# EAGLE design transmitter (EAGLE 9.6.2)
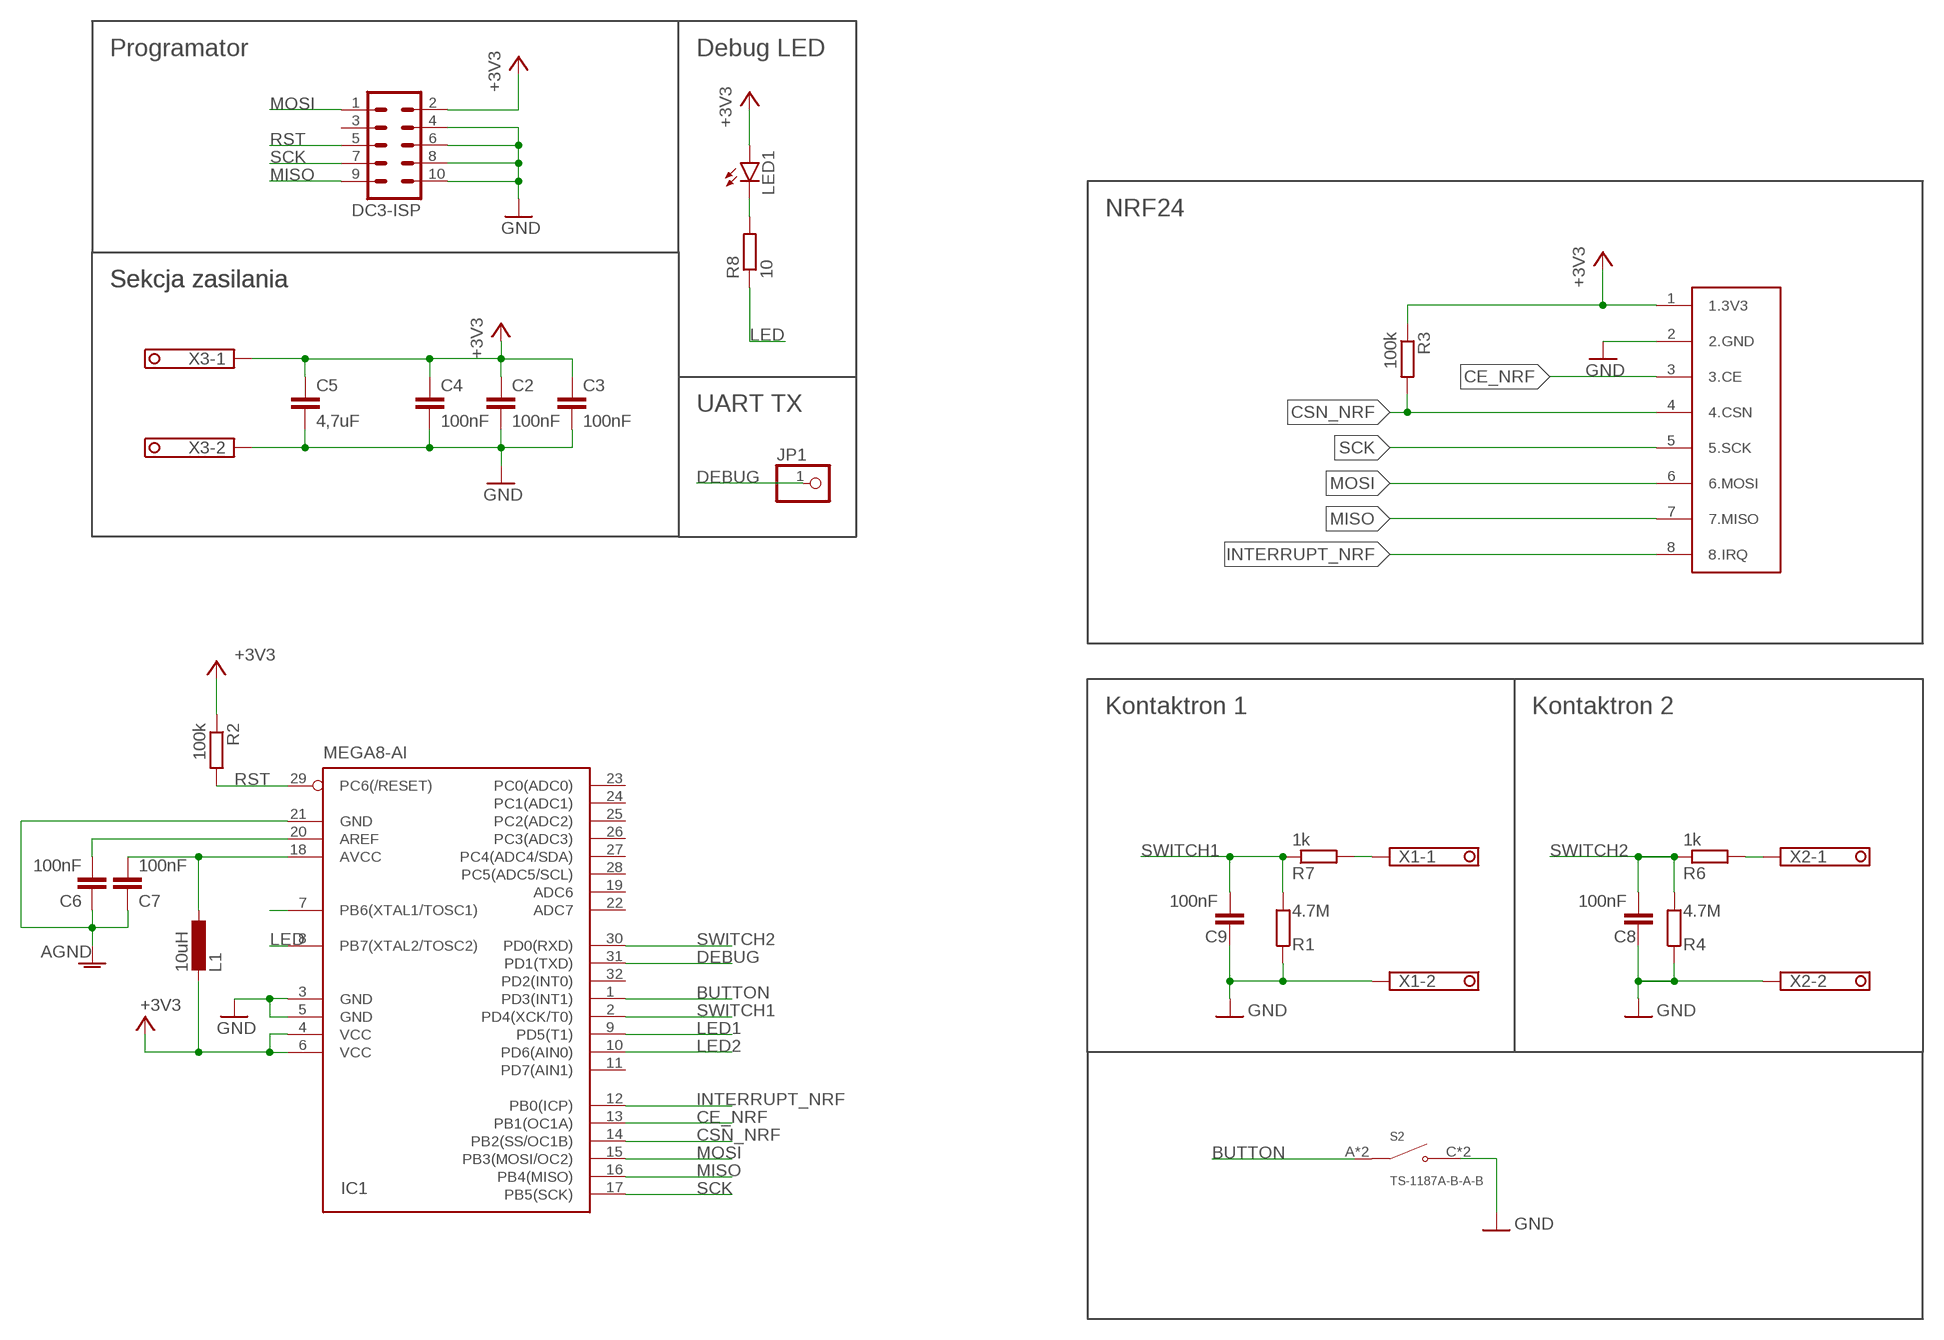
[diagram p0: schematic, sheet 1]

## Parts
C2  100nF  C-EUC0805  [C0805]
C3  100nF  C-EUC0805  [C0805]
C4  100nF  C-EUC0805  [C0805]
C5  4,7uF  C-EU025-050X050  [C025-050X050]
C6  100nF  C-EUC0805  [C0805]
C7  100nF  C-EUC0805  [C0805]
C8  100nF  C-EUC0805  [C0805]
C9  100nF  C-EUC0805  [C0805]
DC3-ISP  ML10  [ML10]
IC1  MEGA8-AI  [TQFP32-08]
JP1  PINHD-1X1  [1X01]
L1  10uH  L-EUL2012C  [L2012C]
LED1  LEDCHIP-LED0805  [CHIP-LED0805]
R1  4.7M  R-EU_M0805  [M0805]
R2  100k  R-EU_M0805  [M0805]
R3  100k  R-EU_M0805  [M0805]
R4  4.7M  R-EU_M0805  [M0805]
R6  1k  R-EU_M0805  [M0805]
R7  1k  R-EU_M0805  [M0805]
R8  10  R-EU_M0805  [M0805]
S2  TS-1187A-B-A-B  [SW_TS-1187A-B-A-B]
U$1  NRF24L01+  [NRF24L01+]
X1  ARK-3.5MMAPC2  [1751248]
X2  ARK-3.5MMAPC2  [1751248]
X3  ARK-3.5MMAPC2  [1751248]

## Nets
+3V3 [vcc]: C2.1 C3.1 C4.1 C5.1 DC3-ISP.2 IC1.4(VCC) IC1.6(VCC) L1.2 LED1.A R2.1 R3.1 U$1.1(1.3V3) X3.1
AGND: C6.1 C7.1 IC1.21(GND)
AREF: C6.2 IC1.20(AREF)
AVCC: C7.2 IC1.18(AVCC) L1.1
BUTTON: IC1.1(PD3(INT1)) S2.A(COM) S2.B(COM)
CE_NRF: IC1.13(PB1(OC1A)) U$1.3(3.CE)
CSN_NRF: IC1.14(PB2(SS/OC1B)) R3.2 U$1.4(4.CSN)
DEBUG: IC1.31(PD1(TXD)) JP1.1
GND [vcc]: C2.2 C3.2 C4.2 C5.2 C8.1 C9.1 DC3-ISP.4 DC3-ISP.6 DC3-ISP.8 DC3-ISP.10 IC1.3(GND) IC1.5(GND) R1.1 R4.1 S2.C(NO) S2.D(NO) U$1.2(2.GND) X1.2 X2.2 X3.2
INTERRUPT_NRF: IC1.12(PB0(ICP)) U$1.8(8.IRQ)
LED: IC1.8(PB7(XTAL2/TOSC2)) R8.1
LED1: IC1.9(PD5(T1))
LED2: IC1.10(PD6(AIN0))
MISO: DC3-ISP.9 IC1.16(PB4(MISO)) U$1.7(7.MISO)
MOSI: DC3-ISP.1 IC1.15(PB3(MOSI/OC2)) U$1.6(6.MOSI)
N$1: IC1.7(PB6(XTAL1/TOSC1))
N$2: LED1.C R8.2
RST: DC3-ISP.5 IC1.29(PC6(/RESET)) R2.2
SCK: DC3-ISP.7 IC1.17(PB5(SCK)) U$1.5(5.SCK)
SWITCH1: C9.2 IC1.2(PD4(XCK/T0)) R1.2 R7.1
SWITCH1_WIRE: R7.2 X1.1
SWITCH2: C8.2 IC1.30(PD0(RXD)) R4.2 R6.1
SWITCH2_WIRE: R6.2 X2.1
Unconnected: DC3-ISP.3 IC1.11(PD7(AIN1)) IC1.19(ADC6) IC1.22(ADC7) IC1.23(PC0(ADC0)) IC1.24(PC1(ADC1)) IC1.25(PC2(ADC2)) IC1.26(PC3(ADC3)) IC1.27(PC4(ADC4/SDA)) IC1.28(PC5(ADC5/SCL)) IC1.32(PD2(INT0))

## Notes on the sheet
- Programator | Debug LED
- NRF24
- Sekcja zasilania | Sekcja zasilania
- UART TX
- Kontaktron 1 | Kontaktron 2

## Library data of the parts
C2-C9 = rcl:C-EU: CAPACITOR, European symbol; SPICEPREFIX: C
DC3-ISP = Connectors:ML10: HARTING; OC_FARNELL: unknown; OC_NEWARK: unknown
IC1 = atmel:MEGA8: MICROCONTROLLER 8 Kbytes FLASH, 1 kbytes SRAM, 512 bytes EEPROM, USART, 6-channel 10 bit ADC, 2-channel 8 bit ADC Pin compatible with Atmega48, ATMega88, ATMega168 Source: avr.lbr; MPN: ATMEGA8-16AU; OC_FARNELL: 9171371; OC_NEWARK: 73M8863
JP1 = Connectors:PINHD-1X1: PIN HEADER
L1 = rcl:L-EU: INDUCTOR, European symbol; SPICEPREFIX: L
LED1 = led:LED: LED OSRAM: - CHIPLED LG R971, LG N971, LY N971, LG Q971, LY Q971, LO R971, LY R971 LH N974, LH R974 LS Q976, LO Q976, LY Q976 LO Q996 - Hyper CHIPLED LW Q18S LB Q993, LB Q99A, LB R99A - SideLED LS A670, LO A670, LY A670, LG A670, LP A670 LB A673, LV A673, LT A673, LW A673 LH A674 LY A675 LS A676, LA A676, LO A676, LY A676, LW A676 LS A679, LY A679, LG A679 - Hyper Micro SIDELED® LS Y876, LA Y876, LO Y876, LY Y876 LT Y87S - SmartLED LW L88C, LW L88S LB L89C, LB L89S, LG L890 LS L89K, LO L89K, LY L89K LS L896, LA L896, LO L896, LY L896 - TOPLED LS T670, LO T670, LY T670, LG T670, LP T670 LSG T670, LSP T670, LSY T670, LOP T670, LYG T670 LG T671, LOG T671, LSG T671 LB T673, LV T673, LT T673, LW T673 LH T674 LS T676, LA T676, LO T676, LY T676, LB T676, LH T676, LSB T676, LW T676 LB T67C, LV T67C, LT T67C, LS T67K, LO T67K, LY T67K, LW E67C LS E67B, LA E67B, LO E67B, LY E67B, LB E67C, LV E67C, LT E67C LW T67C LS T679, LY T679, LG T679 LS T770, LO T770, LY T770, LG T770, LP T770 LB T773, LV T773, LT T773, LW T773 LH T774 LS E675, LA E675, LY E675, LS T675 LS T776, LA T776, LO T776, LY T776, LB T776 LHGB T686 LT T68C, LB T68C - Hyper Mini TOPLED® LB M676 - Mini TOPLED Santana® LG M470 LS M47K, LO M47K, LY M47K Source: http://www.osram.convergy.de LUXEON: - LUMILED® LXK2-PW12-R00, LXK2-PW12-S00, LXK2-PW14-U00, LXK2-PW14-V00 LXK2-PM12-R00, LXK2-PM12-S00, LXK2-PM14-U00 LXK2-PE12-Q00, LXK2-PE12-R00, LXK2-PE12-S00, LXK2-PE14-T00, LXK2-PE14-U00 LXK2-PB12-K00, LXK2-PB12-L00, LXK2-PB12-M00, LXK2-PB14-N00, LXK2-PB14-P00, LXK2-PB14-Q00 LXK2-PR12-L00, LXK2-PR12-M00, LXK2-PR14-Q00, LXK2-PR14-R00 LXK2-PD12-Q00, LXK2-PD12-R00, LXK2-PD12-S00 LXK2-PH12-R00, LXK2-PH12-S00 LXK2-PL12-P00, LXK2-PL12-Q00, LXK2-PL12-R00 Source: www.luxeon.com KINGBRIGHT: KA-3528ASYC Source: www.kingbright.com
R1-R4 R6-R8 = rcl:R-EU_: RESISTOR, European symbol; SPICEPREFIX: R
S2 = Modules:TS-1187A-B-A-B: SPST tact switch
U$1 = Modules:NRF24L01+: NRF24L01+
X1-X3 = Connectors:ARK-3.5MM: MKDS 1/ 2-3,5 Printklemme Nennstrom: 10 A Bemessungsspannung: 160 V Raster: 3,5 mm Polzahl: 2 Montageart: Löten Anschlussart: Schraubanschluss Anschlussrichtung vom Leiter zur Platine: 0° Source: http://eshop.phoenixcontact.com .. 1751248.pdf

## Net classes
0 default: width 0.2 mm, clearance 0.127 mm
1 vcc: width 0.508 mm, clearance 0.152 mm

## Board
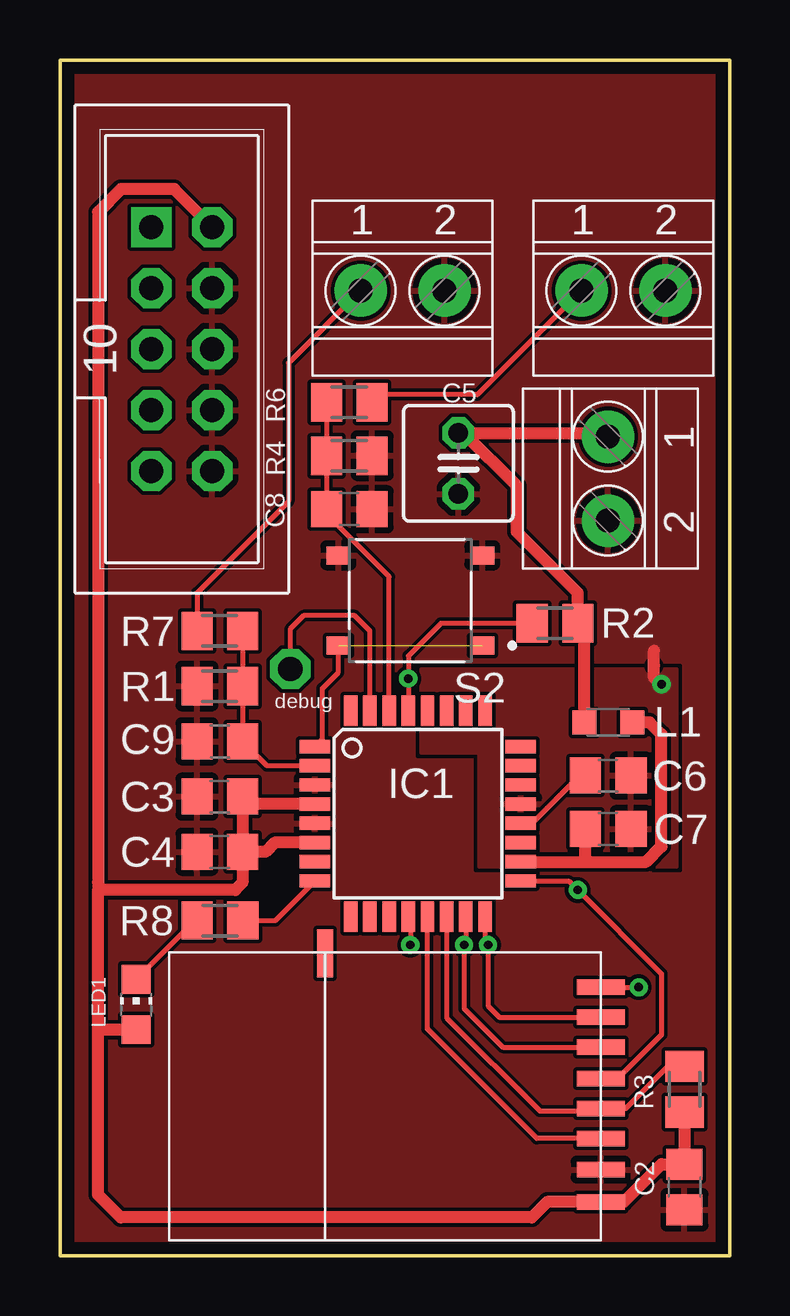
[diagram p1: board, top side]
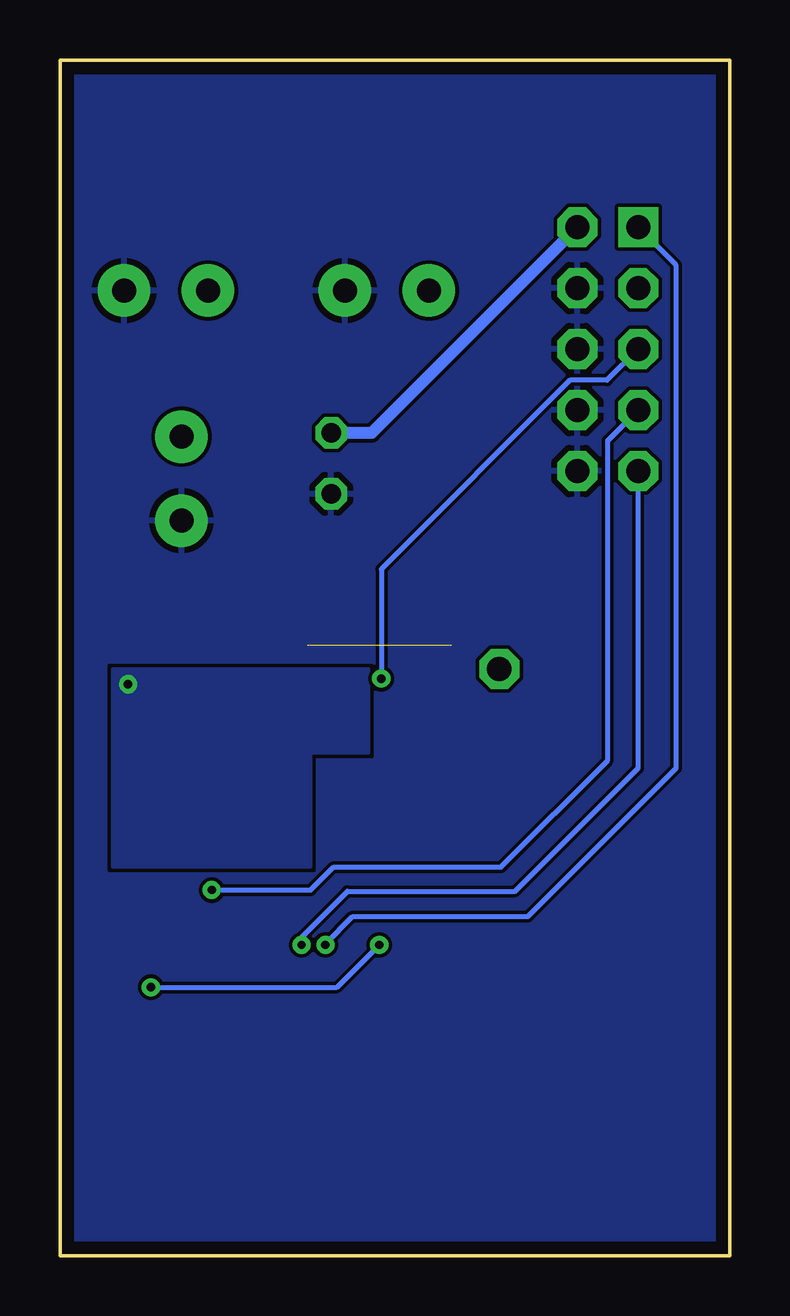
[diagram p2: board, bottom side, seen from below]

Size 27.92 x 49.84 mm. Coordinates in mm from the lower left corner, seen from the top.
Outline: 0,0 27.92,0 27.92,49.84 0,49.84 0,0
Copper layers (1*16): Top 0.035559375mm / dielectric 1.6mm / Bottom 0.035559375mm
Design rules "jlc *": minimum track width 5mil, minimum drill 13mil, track to track 6mil, track to pad 6mil, pad to pad 6mil, via to via 6mil, smd to smd 6mil, copper to edge 20mil, drill to drill 6mil, minimum pad ring 10mil, minimum via ring 8mil, stop-mask expansion 4mil, vias tented up to drill 0mil, thermal gap 10mil

### Footprints (pad centres in the part's own frame; a part is rotated, then mirrored left to right if it is on the bottom)
C0805 = smd 1.3 x 1.5: 1 -0.95,0; 2 0.95,0
C025-050X050 = drill 0.813 octagon: 1 -1.27,0; 2 1.27,0
ML10 = drill 1 pad 1.676 square: 1 -5.08,-1.27 | drill 1 pad 1.676 octagon: 2 -5.08,1.27; 3 -2.54,-1.27; 4 -2.54,1.27; 5 0,-1.27; 6 0,1.27; 7 2.54,-1.27; 8 2.54,1.27; 9 5.08,-1.27; 10 5.08,1.27
TQFP32-08 = smd 1.27 x 0.559: 1 -4.293,2.8; 2 -4.293,2; 3 -4.293,1.2; 4 -4.293,0.4; 5 -4.293,-0.4; 6 -4.293,-1.2; 7 -4.293,-2; 8 -4.293,-2.8; 17 4.293,-2.8; 18 4.293,-2; 19 4.293,-1.2; 20 4.293,-0.4; 21 4.293,0.4; 22 4.293,1.2; 23 4.293,2; 24 4.293,2.8 | smd 0.559 x 1.27: 9 -2.8,-4.293; 10 -2,-4.293; 11 -1.2,-4.293; 12 -0.4,-4.293; 13 0.4,-4.293; 14 1.2,-4.293; 15 2,-4.293; 16 2.8,-4.293; 25 2.8,4.293; 26 2,4.293; 27 1.2,4.293; 28 0.4,4.293; 29 -0.4,4.293; 30 -1.2,4.293; 31 -2,4.293; 32 -2.8,4.293
1X01 = drill 1.016 pad 1.676 octagon: 1 0,0
L2012C = smd 1 x 1: 1 -1,0; 2 1,0
CHIP-LED0805 = smd 1.2 x 1.2: A 0,-1.05; C 0,1.05
M0805 = smd 1.3 x 1.6: 1 -0.95,0; 2 0.95,0
SW_TS-1187A-B-A-B = smd 1 x 0.75: A -3,1.875; B 3,1.875; C -3,-1.875; D 3,-1.875
NRF24L01+ = smd 0.65 x 2: 1 1.6,0; 2 2.95,0; 3 4.25,0; 4 5.5,0; 5 6.75,0; 6 8.05,0; 7 9.3,0; 8 10.55,0 | smd 2 x 0.65: 9 11.96,11.49
1751248 = drill 1 pad 2.184: 1 -1.75,-0.1; 2 1.75,-0.1

### Placement (x,y rotation side)
C2  26.04,2.86 270 top
C3  6.66,19.13 180 top
C4  6.66,16.83 180 top
C5  16.61,33.02 270 top
C6  22.86,20 180 top
C7  22.86,17.78 180 top
C8  12.06,31.11 180 top
C9  6.66,21.43 0 top
DC3-ISP  5.08,37.78 270 top
IC1  14.92,18.41 0 top
JP1  9.6,24.45 0 top
L1  22.86,22.23 180 top
LED1  3.17,10.47 0 top
R1  6.66,23.73 0 top
R2  20.64,26.35 180 top
R3  26.04,6.93 90 top
R4  12.06,33.34 180 top
R6  12.06,35.56 0 top
R7  6.66,26.04 180 top
R8  6.67,13.97 180 top
S2  14.61,27.3 180 top
U$1  22.54,0.64 90 top
X1  14.29,40.32 0 top
X2  23.5,40.32 0 top
X3  22.95,32.38 270 top

### Tracks (layer width: path | path; a pad name or v marks a point on that pad's centre or on a via)
+3V3
  Top 0.508: 1.59,15.24 7.3,15.24 7.61,15.55 C4.1 | IC1.6 8.96,17.21 8.57,16.83 C4.1 | R3.1 C2.1 25.08,3.81 23.5,2.22 23.48,2.23 U$1.1 20.32,2.23 19.67,1.59 2.54,1.59 1.59,2.54 1.59,9.53 | 1.59,15.56 1.59,43.5 2.54,44.45 4.76,44.45 DC3-ISP.2 | 1.59,15.56 1.59,15.24 | X3.1 22.61,34.29 C5.1 16.83,34.29 19.05,32.07 19.05,30.16 21.59,27.62 R2.1 21.86,26.08 L1.2 21.91,22.27 | IC1.4 7.93,18.82 C3.1 C4.1 | 1.59,15.56 1.59,15.55 | 1.59,9.53 1.59,15.24 | LED1.A 1.7,9.42 1.59,9.53
  Bottom 0.508: C5.1 14.92,34.29 DC3-ISP.2
AGND  (via drill 0.35)
  Top 0.508: 24.77,24.08 24.77,24.58
  other vias: 25.08,23.81
  pour Top: 15.05,24.45 25.72,24.45 25.72,16.19 17.46,16.19 17.46,20.95 15.05,20.95
  pour Bottom: 15.05,24.45 25.72,24.45 25.72,16.19 17.46,16.19 17.46,20.95 15.05,20.95
AREF
  Top 0.2: IC1.20 19.69,18.02 21.67,20 C6.2
AVCC
  Top 0.2: C7.2
  Top 0.508: 21.91,16.41 24.45,16.41 25.08,17.05 25.08,21.72 24.58,22.23 L1.1 | IC1.18 21.91,16.41 | 21.91,16.41 C7.2
BUTTON  (1 unrouted)
  Top 0.2: S2.B 11.61,24.3 10.95,23.65 10.95,21.53 IC1.1
CE_NRF
  Top 0.2: U$1.3 19.88,4.88 15.32,9.44 IC1.13
CSN_NRF
  Top 0.2: IC1.14 16.12,9.91 20,6.03 22.44,6.03 U$1.4 23.6,6.13 25.35,7.88 R3.2
DEBUG
  Top 0.2: IC1.31 12.92,26.04 12.29,26.67 10.16,26.67 9.6,26.11 JP1.1
GND
  Top 0.508: 24.77,24.6 24.77,25.2
  pour Bottom (rank 2): 0,0 27.94,0 27.94,49.85 0,49.85
  pour Top (rank 4): 0,0 27.94,0 27.94,49.85 0,49.85
INTERRUPT_NRF  (via drill 0.35)
  Top 0.2: IC1.12 14.61,14.04 v14.61,12.95 | U$1.8 v24.13,11.19
  Bottom 0.2: v24.13,11.19 16.37,11.19 v14.61,12.95
LED
  Top 0.2: R8.1 8.98,13.97 IC1.8
MISO  (via drill 0.35)
  Top 0.2: U$1.7 18.32,9.94 17.85,10.41 v17.85,12.95 17.72,13.07 IC1.16
  Bottom 0.2: DC3-ISP.9 3.81,20.32 8.95,15.18 15.93,15.18 17.85,13.27 v17.85,12.95
MOSI  (via drill 0.35)
  Top 0.2: U$1.6 18.46,8.69 16.85,10.3 v16.85,12.95 16.92,13.02 IC1.15
  Bottom 0.2: DC3-ISP.1 2.22,41.27 2.22,20.32 8.41,14.13 15.72,14.13 16.85,12.99 v16.85,12.95
N$2
  Top 0.2: R8.2 5.63,13.97 LED1.C
RST  (via drill 0.35)
  Top 0.2: IC1.29 v14.52,24.05 14.52,25 15.88,26.35 R2.2
  Bottom 0.2: DC3-ISP.5 5.11,36.48 6.65,36.48 14.52,28.61 v14.52,24.05
SCK  (via drill 0.35)
  Top 0.2: U$1.5 23.09,7.38 23.18,7.3 25.08,9.21 25.08,11.75 v21.59,15.24 21.21,15.62 IC1.17
  Bottom 0.2: v21.59,15.24 17.46,15.24 16.51,16.19 9.53,16.19 5.08,20.64 5.08,33.97 DC3-ISP.7
SWITCH1
  Top 0.2: R7.1 R1.2 C9.2 8.63,20.41 IC1.2
SWITCH1_WIRE
  Top 0.2: R7.2 5.71,27.62 9.53,31.43 9.53,37.21 X1.1
SWITCH2
  Top 0.2: R6.1 R4.2 C8.2 11.12,30.9 13.72,28.29 IC1.30
SWITCH2_WIRE
  Top 0.2: R6.2 13.33,35.88 17.4,35.88 X2.1

### Text on the board
tNames: debug
opis_dol: MOSI | VCC | NC | GND | RST | GND | CSK | GND | VCC | MISO | GND | GND | Dominik Nowocien / v1.0
opis_gora: sensor1 | sensor2 | VCC | GND | NRF24L01+
_tNames: R6 | C5 | R4 | C8 | R7 | R2 | R1 | S2 | C9 | L1 | C3 | IC1 | C6 | C4 | C7 | R8 | LED1 | R3 | C2